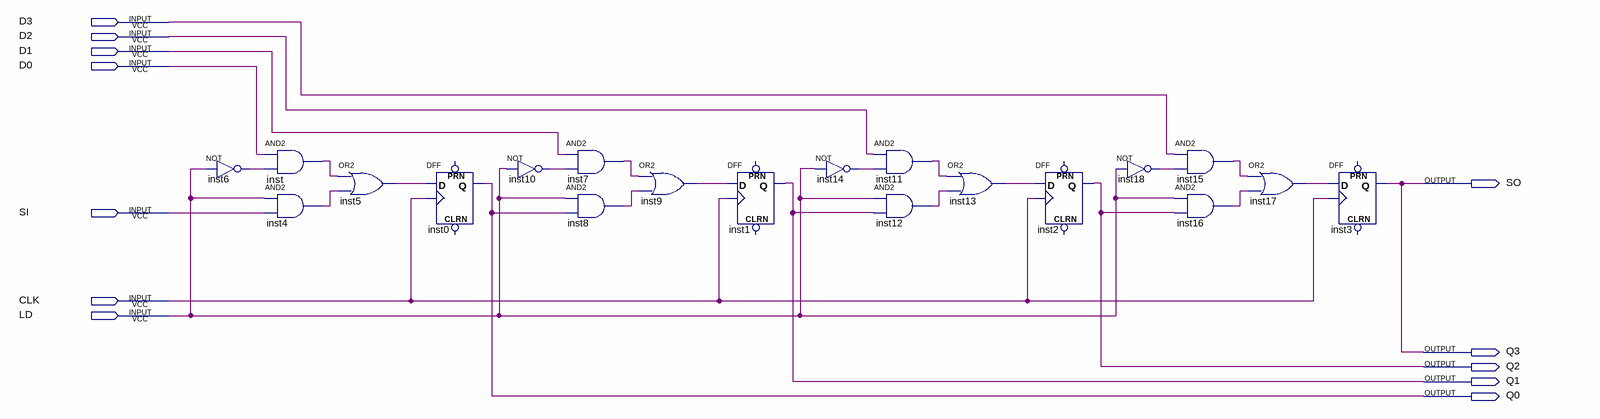
[diagram p0: schematic sheet]
// Quartus schematic CounterShiftReg.bdf as structural Verilog: 20 symbols, 12 pins
module CounterShiftReg (
  input  D3,
  input  D2,
  input  D1,
  input  D0,
  input  SI,
  input  CLK,
  input  LD,
  output SO,
  output Q3,
  output Q2,
  output Q1,
  output Q0
);

  wire inst4_out, inst5_out, inst6_out, inst7_out, inst8_out, inst9_out, inst10_out, inst11_out, inst12_out,
       inst13_out, inst14_out, inst15_out, inst16_out, inst17_out, inst18_out, inst_out;

  not inst6 (inst6_out, LD);
  and inst (inst_out, D0, inst6_out);
  and inst4 (inst4_out, LD, SI);
  or inst5 (inst5_out, inst_out, inst4_out);
  DFF inst0 (.CLK(CLK), .D(inst5_out), .Q(Q0));  // open: CLRN, PRN
  not inst10 (inst10_out, LD);
  and inst7 (inst7_out, D1, inst10_out);
  and inst8 (inst8_out, LD, Q0);
  or inst9 (inst9_out, inst7_out, inst8_out);
  DFF inst1 (.CLK(CLK), .D(inst9_out), .Q(Q1));  // open: CLRN, PRN
  not inst14 (inst14_out, LD);
  and inst11 (inst11_out, D2, inst14_out);
  and inst12 (inst12_out, LD, Q1);
  or inst13 (inst13_out, inst11_out, inst12_out);
  DFF inst2 (.CLK(CLK), .D(inst13_out), .Q(Q2));  // open: CLRN, PRN
  not inst18 (inst18_out, LD);
  and inst15 (inst15_out, D3, inst18_out);
  and inst16 (inst16_out, LD, Q2);
  or inst17 (inst17_out, inst15_out, inst16_out);
  DFF inst3 (.CLK(CLK), .D(inst17_out), .Q(Q3));  // open: CLRN, PRN

  assign SO = Q3;
endmodule
